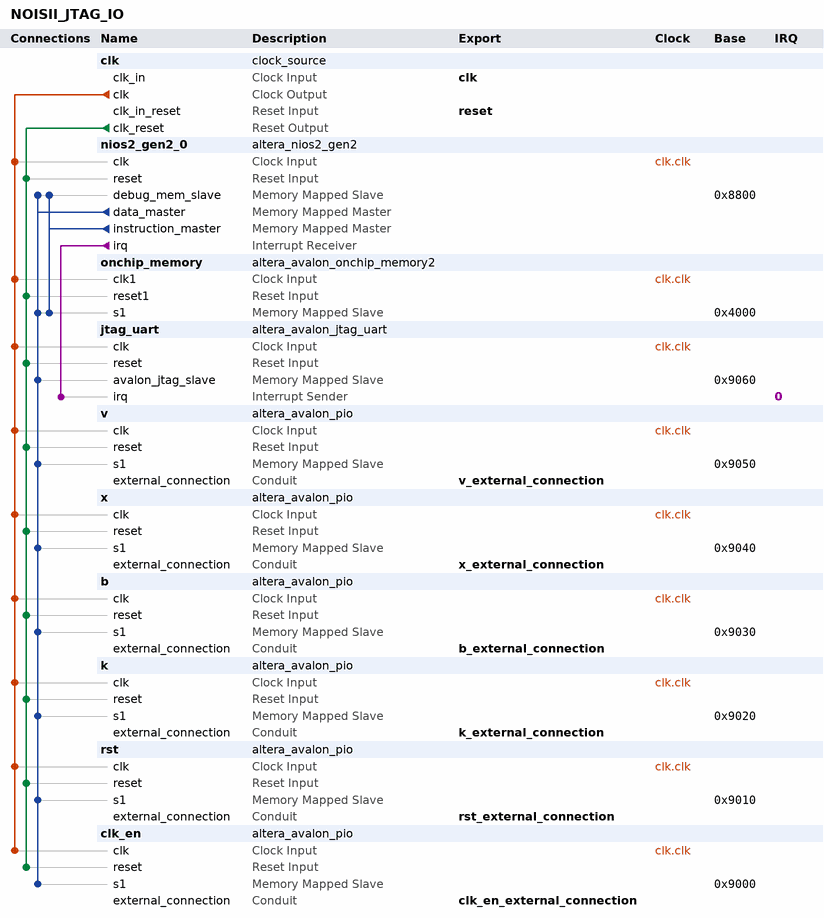
[diagram p0: system contents]
# Platform Designer (Qsys) system NOISII_JTAG_IO, Cyclone IV E EP4CE10E22A7
# Parameters at their usual value, and those the tool derives, are not listed.
package require -exact qsys 20.1
create_system NOISII_JTAG_IO
set_project_property DEVICE_FAMILY {Cyclone IV E}
set_project_property DEVICE EP4CE10E22A7

add_instance clk clock_source 20.1
set_instance_parameter_value clk clockFrequency 50000000

add_instance nios2_gen2_0 altera_nios2_gen2 20.1
set_instance_parameter_value nios2_gen2_0 dcache_size 2048
set_instance_parameter_value nios2_gen2_0 exceptionSlave onchip_memory.s1
set_instance_parameter_value nios2_gen2_0 icache_size 4096
set_instance_parameter_value nios2_gen2_0 impl Tiny
set_instance_parameter_value nios2_gen2_0 resetSlave onchip_memory.s1

add_instance onchip_memory altera_avalon_onchip_memory2 20.1
set_instance_parameter_value onchip_memory dataWidth 32
set_instance_parameter_value onchip_memory dualPort false
set_instance_parameter_value onchip_memory initMemContent false
set_instance_parameter_value onchip_memory initializationFileName onchip_mem.hex
set_instance_parameter_value onchip_memory memorySize 16384

add_instance jtag_uart altera_avalon_jtag_uart 20.1
set_instance_parameter_value jtag_uart simInteractiveOptions NO_INTERACTIVE_WINDOWS

add_instance v altera_avalon_pio 20.1
set_instance_parameter_value v direction Output
set_instance_parameter_value v width 18

add_instance x altera_avalon_pio 20.1
set_instance_parameter_value x direction Output
set_instance_parameter_value x width 18

add_instance b altera_avalon_pio 20.1
set_instance_parameter_value b direction Output
set_instance_parameter_value b width 18

add_instance k altera_avalon_pio 20.1
set_instance_parameter_value k direction Output
set_instance_parameter_value k width 18

add_instance rst altera_avalon_pio 20.1
set_instance_parameter_value rst direction Output
set_instance_parameter_value rst width 1

add_instance clk_en altera_avalon_pio 20.1
set_instance_parameter_value clk_en direction Output
set_instance_parameter_value clk_en width 1

# connections
add_connection clk.clk b.clk clock
add_connection clk.clk clk_en.clk clock
add_connection clk.clk jtag_uart.clk clock
add_connection clk.clk k.clk clock
add_connection clk.clk nios2_gen2_0.clk clock
add_connection clk.clk onchip_memory.clk1 clock
add_connection clk.clk rst.clk clock
add_connection clk.clk v.clk clock
add_connection clk.clk x.clk clock
add_connection clk.clk_reset b.reset reset
add_connection clk.clk_reset clk_en.reset reset
add_connection clk.clk_reset jtag_uart.reset reset
add_connection clk.clk_reset k.reset reset
add_connection clk.clk_reset nios2_gen2_0.reset reset
add_connection clk.clk_reset onchip_memory.reset1 reset
add_connection clk.clk_reset rst.reset reset
add_connection clk.clk_reset v.reset reset
add_connection clk.clk_reset x.reset reset
add_connection nios2_gen2_0.data_master b.s1 avalon
set_connection_parameter_value nios2_gen2_0.data_master/b.s1 baseAddress 0x9030
add_connection nios2_gen2_0.data_master clk_en.s1 avalon
set_connection_parameter_value nios2_gen2_0.data_master/clk_en.s1 baseAddress 0x9000
add_connection nios2_gen2_0.data_master jtag_uart.avalon_jtag_slave avalon
set_connection_parameter_value nios2_gen2_0.data_master/jtag_uart.avalon_jtag_slave baseAddress 0x9060
add_connection nios2_gen2_0.data_master k.s1 avalon
set_connection_parameter_value nios2_gen2_0.data_master/k.s1 baseAddress 0x9020
add_connection nios2_gen2_0.data_master nios2_gen2_0.debug_mem_slave avalon
set_connection_parameter_value nios2_gen2_0.data_master/nios2_gen2_0.debug_mem_slave baseAddress 0x8800
add_connection nios2_gen2_0.data_master onchip_memory.s1 avalon
set_connection_parameter_value nios2_gen2_0.data_master/onchip_memory.s1 baseAddress 0x4000
add_connection nios2_gen2_0.data_master rst.s1 avalon
set_connection_parameter_value nios2_gen2_0.data_master/rst.s1 baseAddress 0x9010
add_connection nios2_gen2_0.data_master v.s1 avalon
set_connection_parameter_value nios2_gen2_0.data_master/v.s1 baseAddress 0x9050
add_connection nios2_gen2_0.data_master x.s1 avalon
set_connection_parameter_value nios2_gen2_0.data_master/x.s1 baseAddress 0x9040
add_connection nios2_gen2_0.instruction_master nios2_gen2_0.debug_mem_slave avalon
set_connection_parameter_value nios2_gen2_0.instruction_master/nios2_gen2_0.debug_mem_slave baseAddress 0x8800
add_connection nios2_gen2_0.instruction_master onchip_memory.s1 avalon
set_connection_parameter_value nios2_gen2_0.instruction_master/onchip_memory.s1 baseAddress 0x4000
add_connection nios2_gen2_0.irq jtag_uart.irq interrupt
set_connection_parameter_value nios2_gen2_0.irq/jtag_uart.irq irqNumber 0

# exported interfaces
add_interface b_external_connection conduit end
set_interface_property b_external_connection EXPORT_OF b.external_connection
add_interface clk clock sink
set_interface_property clk EXPORT_OF clk.clk_in
add_interface clk_en_external_connection conduit end
set_interface_property clk_en_external_connection EXPORT_OF clk_en.external_connection
add_interface k_external_connection conduit end
set_interface_property k_external_connection EXPORT_OF k.external_connection
add_interface reset reset sink
set_interface_property reset EXPORT_OF clk.clk_in_reset
add_interface rst_external_connection conduit end
set_interface_property rst_external_connection EXPORT_OF rst.external_connection
add_interface v_external_connection conduit end
set_interface_property v_external_connection EXPORT_OF v.external_connection
add_interface x_external_connection conduit end
set_interface_property x_external_connection EXPORT_OF x.external_connection

set_interconnect_requirement {$system} qsys_mm.clockCrossingAdapter HANDSHAKE
set_interconnect_requirement {$system} qsys_mm.enableEccProtection FALSE
set_interconnect_requirement {$system} qsys_mm.insertDefaultSlave FALSE
set_interconnect_requirement {$system} qsys_mm.maxAdditionalLatency 1

save_system NOISII_JTAG_IO.qsys
